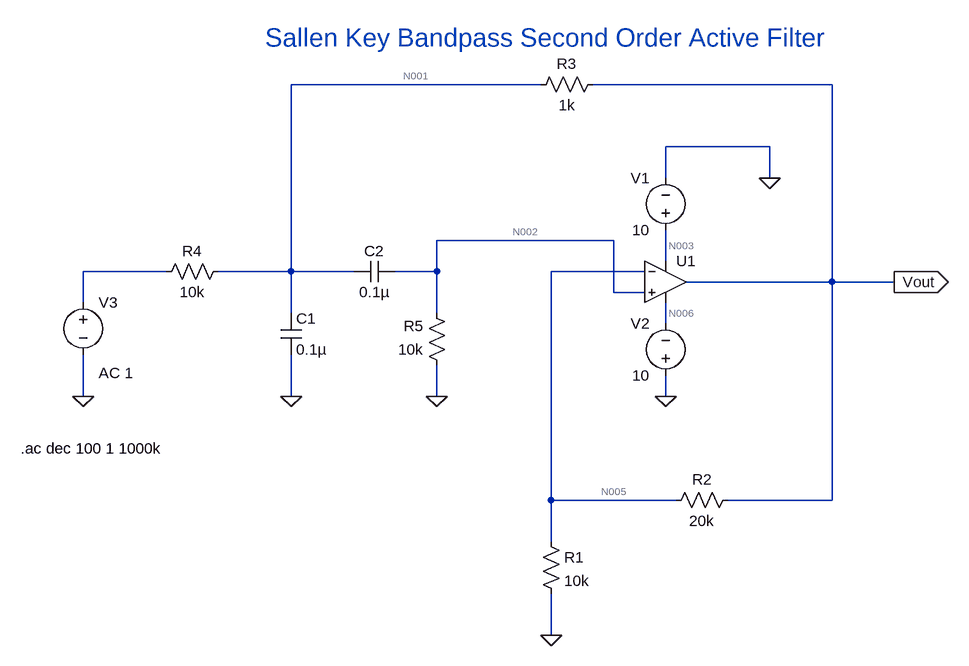
[diagram p0: schematic Second Order Bandpass Active Filter.asc]
Second Order Bandpass Active Filter.asc, the LTspice schematic file:
Version 4
SHEET 1 880 740
WIRE 80 -128 -304 -128
WIRE 528 -128 160 -128
WIRE 432 -32 272 -32
WIRE 272 16 272 -32
WIRE 432 16 432 -32
WIRE 192 112 -80 112
WIRE 272 144 272 96
WIRE -496 160 -624 160
WIRE -304 160 -304 -128
WIRE -304 160 -416 160
WIRE -208 160 -304 160
WIRE -80 160 -80 112
WIRE -80 160 -144 160
WIRE 240 160 96 160
WIRE 528 176 528 -128
WIRE 528 176 304 176
WIRE 624 176 528 176
WIRE 192 192 192 112
WIRE 240 192 192 192
WIRE -624 208 -624 160
WIRE -304 224 -304 160
WIRE -80 224 -80 160
WIRE 272 240 272 208
WIRE -624 352 -624 288
WIRE -304 352 -304 288
WIRE -80 352 -80 304
WIRE 272 352 272 320
WIRE 96 512 96 160
WIRE 288 512 96 512
WIRE 528 512 528 176
WIRE 528 512 368 512
WIRE 96 576 96 512
WIRE 96 720 96 656
FLAG -624 352 0
FLAG 272 352 0
FLAG 432 16 0
FLAG -304 352 0
FLAG -80 352 0
FLAG 96 720 0
FLAG 624 176 Vout
IOPIN 624 176 Out
SYMBOL Opamps\\UniversalOpamp2 272 176 R0
SYMATTR InstName U1
SYMBOL voltage 272 112 R180
WINDOW 0 24 96 Left 2
WINDOW 3 24 16 Left 2
WINDOW 123 0 0 Left 0
WINDOW 39 0 0 Left 0
SYMATTR InstName V1
SYMATTR Value 10
SYMBOL voltage 272 336 R180
WINDOW 0 24 96 Left 2
WINDOW 3 24 16 Left 2
WINDOW 123 0 0 Left 0
WINDOW 39 0 0 Left 0
SYMATTR InstName V2
SYMATTR Value 10
SYMBOL res 80 560 R0
SYMATTR InstName R1
SYMATTR Value 10k
SYMBOL res 384 496 R90
WINDOW 0 0 56 VBottom 2
WINDOW 3 32 56 VTop 2
SYMATTR InstName R2
SYMATTR Value 20k
SYMBOL res 176 -144 R90
WINDOW 0 0 56 VBottom 2
WINDOW 3 32 56 VTop 2
SYMATTR InstName R3
SYMATTR Value 1k
SYMBOL res -400 144 R90
WINDOW 0 0 56 VBottom 2
WINDOW 3 32 56 VTop 2
SYMATTR InstName R4
SYMATTR Value 10k
SYMBOL res -64 320 R180
WINDOW 0 36 76 Left 2
WINDOW 3 36 40 Left 2
SYMATTR InstName R5
SYMATTR Value 10k
SYMBOL cap -320 224 R0
SYMATTR InstName C1
SYMATTR Value 0.1µ
SYMBOL cap -144 144 R90
WINDOW 0 0 32 VBottom 2
WINDOW 3 32 32 VTop 2
SYMATTR InstName C2
SYMATTR Value 0.1µ
SYMBOL voltage -624 192 R0
WINDOW 123 24 124 Left 2
WINDOW 39 0 0 Left 0
SYMATTR InstName V3
SYMATTR Value ""
SYMATTR Value2 AC 1
TEXT -344 -200 Left 4 ;Sallen Key Bandpass Second Order Active Filter
TEXT -720 432 Left 2 !.ac dec 100 1 1000k

The netlist it stands for:
* Second Order Bandpass Active Filter.asc
XU1 N002 N005 N003 N006 Vout level.2 Avol=1Meg GBW=10Meg Slew=10Meg ilimit=25m rail=0 Vos=0 phimargin=45 en=0 enk=0 in=0 ink=0 Rin=500Meg  ; pins IN+ IN- V+ V- OUT
V1 N003 0 10
V2 0 N006 10
R1 N005 0 10k
R2 Vout N005 20k
R3 Vout N001 1k
R4 N001 N004 10k
R5 0 N002 10k
C1 N001 0 0.1µ
C2 N002 N001 0.1µ
V3 N004 0 AC 1
* Sallen Key Bandpass Second Order Active Filter
.ac dec 100 1 1000k
.lib UniversalOpamps2.sub
.backanno
.end

* Results of the author's LTspice run, read from the files saved beside the schematic
* Operating Point, zero values left out:
*   V(n003) = 10 V
*   V(n006) = -10 V
*   I(V2) = -999.5 µA
*   I(V1) = -999.5 µA
*   Ix(u1:3) = 999.5 µA
*   Ix(u1:4) = -999.5 µA
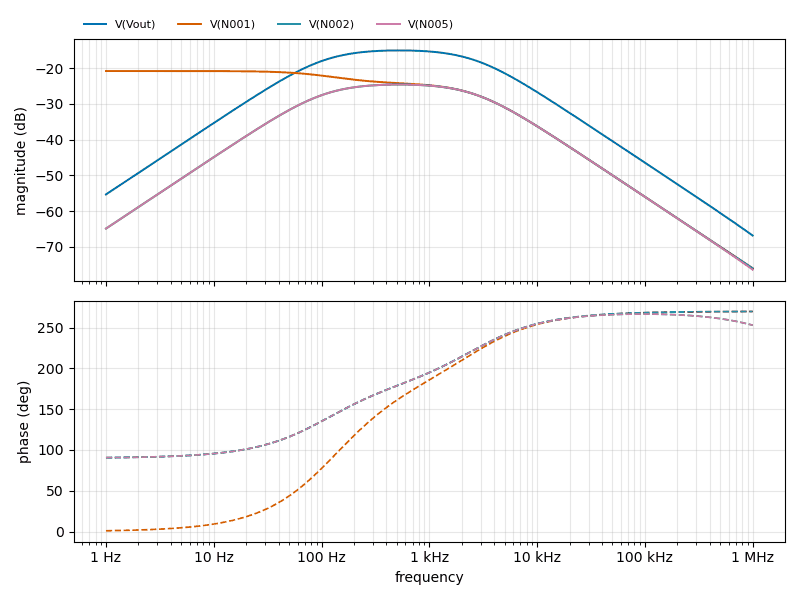
[diagram p1: AC Analysis of Second Order Bandpass Active Filter.asc, plotted from the saved traces]
* AC Analysis, 1 run:
*   V(Vout): -55.32 dB at 1 Hz, -66.82 dB at 1 MHz, peak -15.07 dB at 524.8 Hz, 3 dB below the peak at 99.34 Hz and 2.801 kHz
*   V(N001): -20.83 dB at 1 Hz, -75.98 dB at 1 MHz, peak -20.83 dB at 1 Hz, 3 dB below the peak at 324.4 Hz
*   V(N002): -64.86 dB at 1 Hz, -75.98 dB at 1 MHz, peak -24.61 dB at 524.8 Hz, 3 dB below the peak at 99.34 Hz and 2.801 kHz
*   V(N005): -64.86 dB at 1 Hz, -76.36 dB at 1 MHz, peak -24.61 dB at 524.8 Hz, 3 dB below the peak at 99.34 Hz and 2.801 kHz